# EasyEDA Pro project ProProject_flex_ir_golf_2024-07-23.epro

# Schematic Schematic1
Create Date: 2024-04-06; Page Name: P1; Project Name: flex_ir_golf; Schematic Name: Schematic1; Update Date: 2024-07-07; Company: EasyEDA.com; Drawn: EasyEDA; Page Size: A4; Part Number: JLCPCB-002; Reviewed: EasyEDA; Version: V0.1
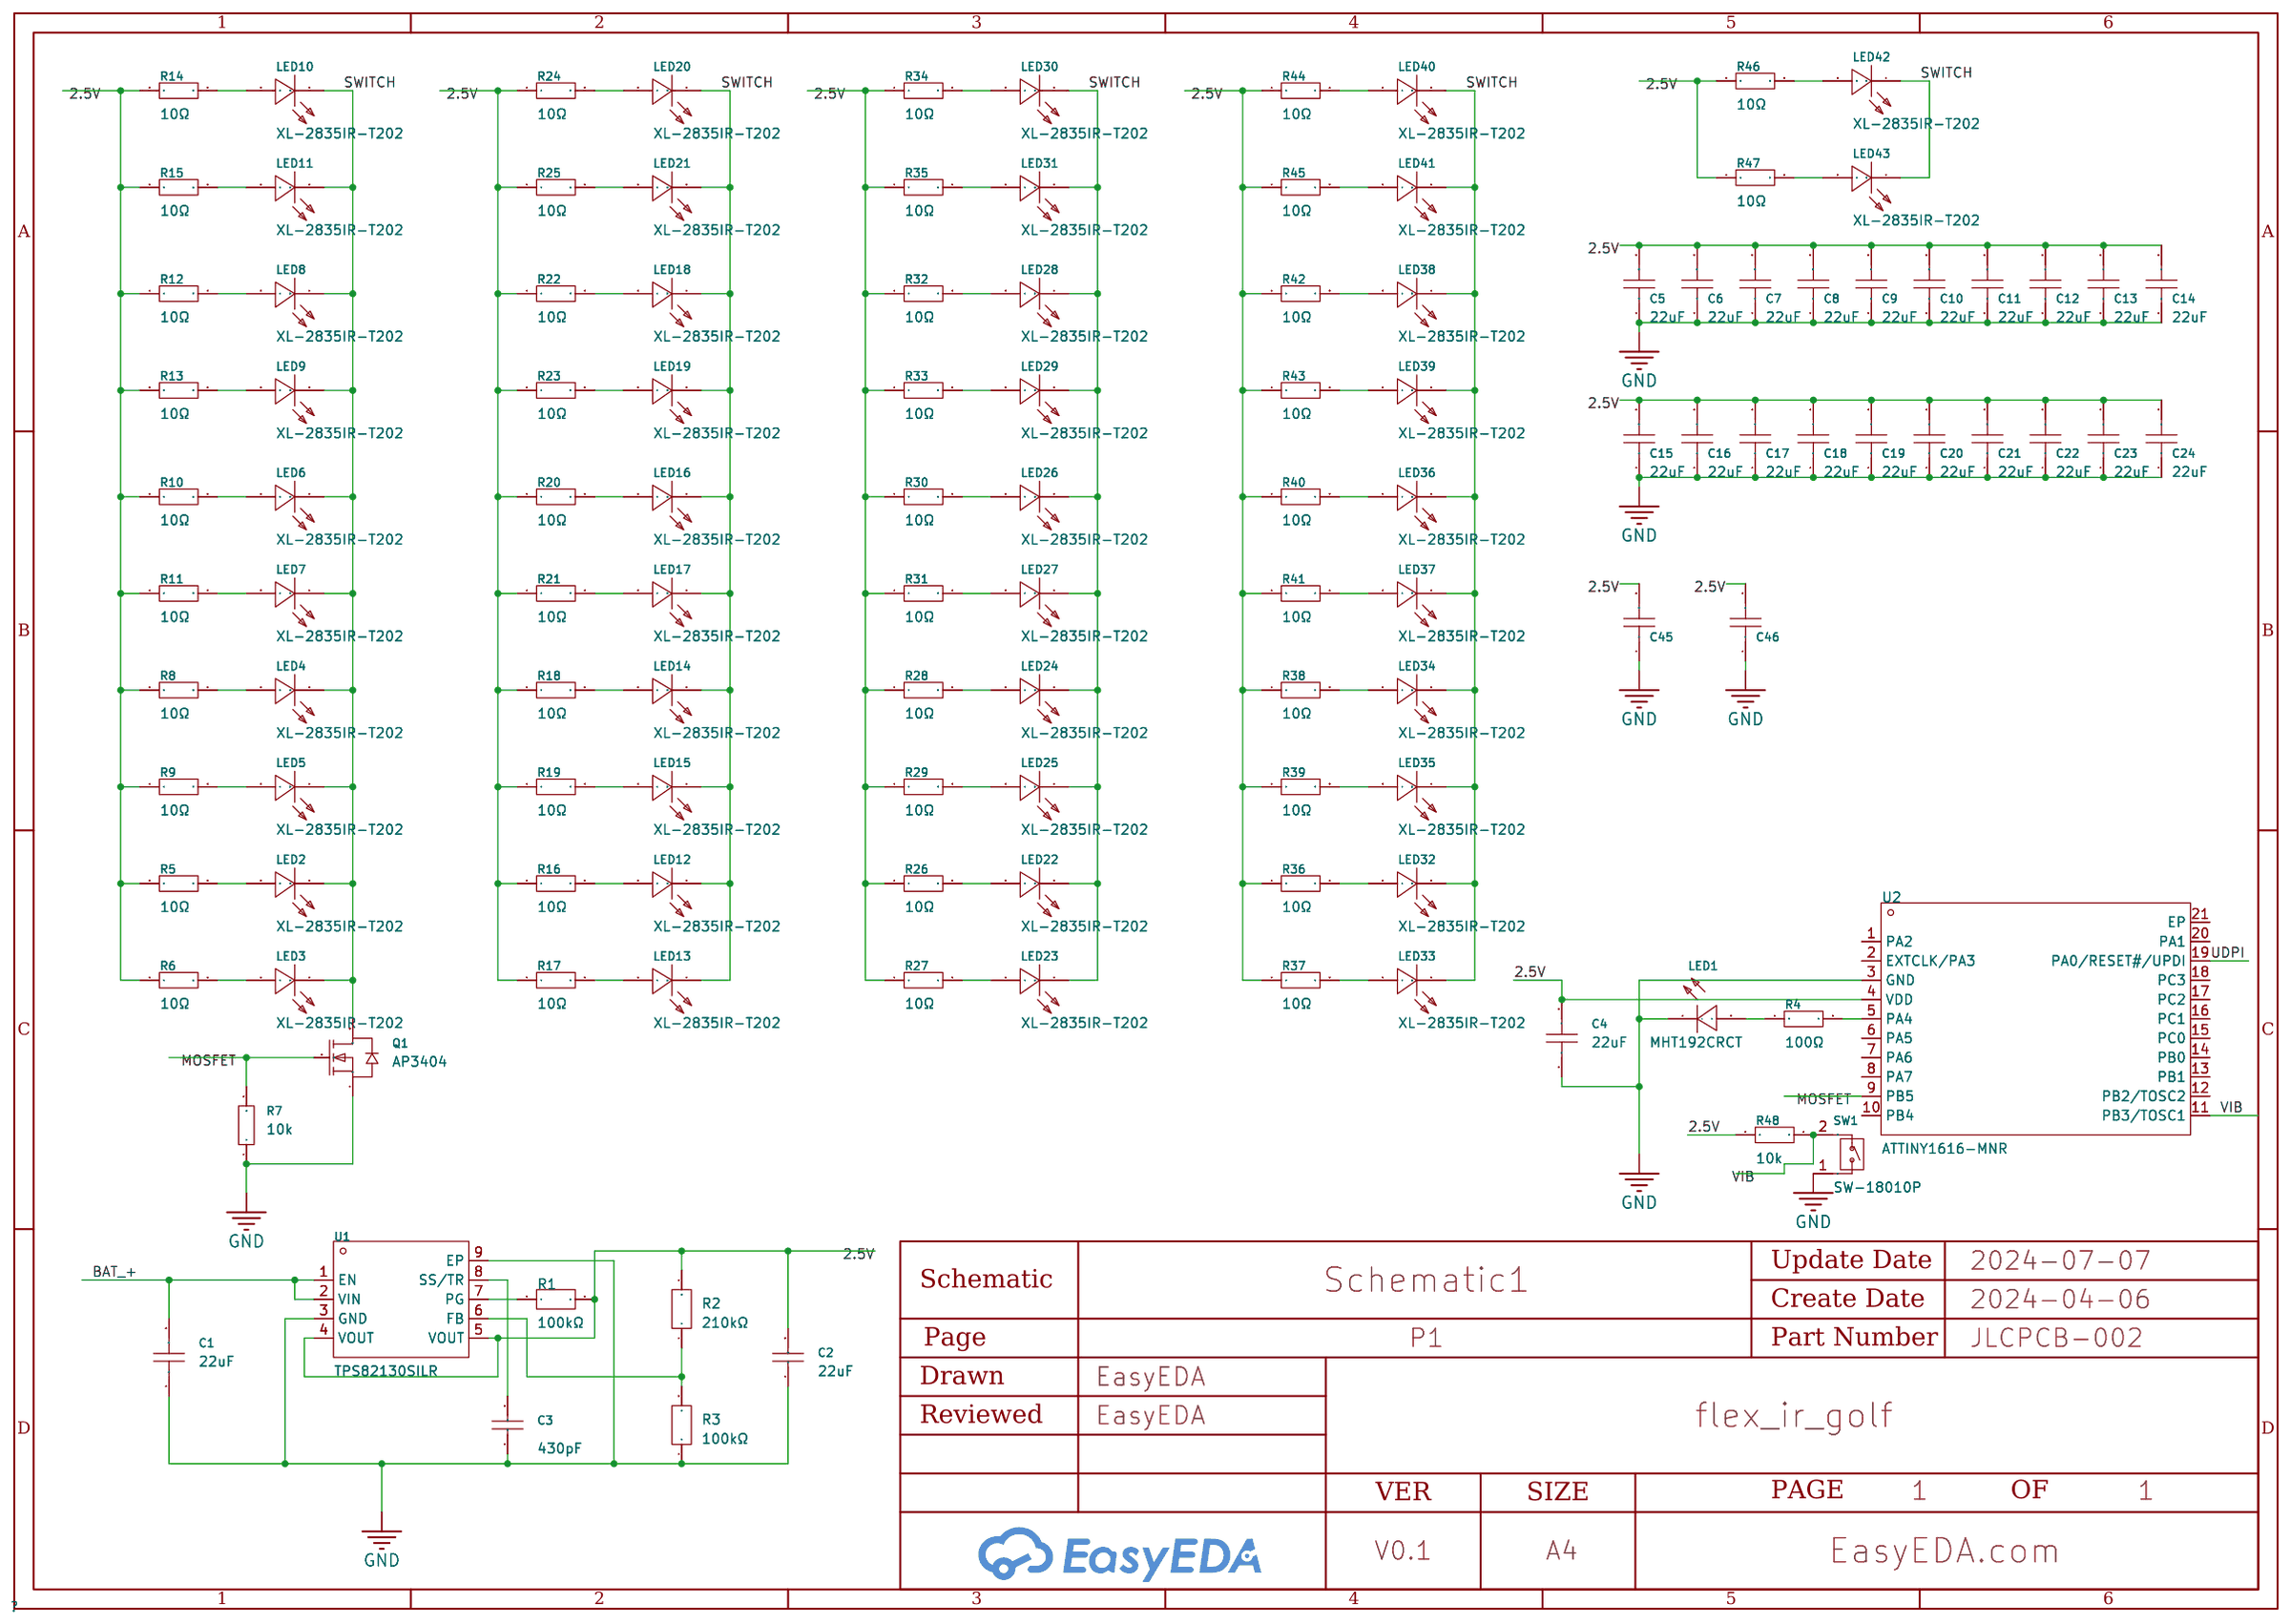
[diagram p0: schematic sheet]

## Parts
C1  22uF  [C0603]
C2  22uF  [C0805]
C3  1uF  [C0402]
C4  22uF  [C0603]
C5  22uF  [C0603]
C6  22uF  [C0603]
C7  22uF  [C0603]
C8  22uF  [C0603]
C9  22uF  [C0603]
C10  22uF  [C0603]
C11  22uF  [C0603]
C12  22uF  [C0603]
C13  22uF  [C0603]
C14  22uF  [C0603]
C15  22uF  [C0603]
C16  22uF  [C0603]
C17  22uF  [C0603]
C18  22uF  [C0603]
C19  22uF  [C0603]
C20  22uF  [C0603]
C21  22uF  [C0603]
C22  22uF  [C0603]
C23  22uF  [C0603]
C24  22uF  [C0603]
C45  22uF  [C0603]
C46  22uF  [C0603]
LED1  MHT192CRCT  [LED0603-RD]
LED2  XL-2835IR-T202  [LED-SMD_L128-XX80CB3500001]
LED3  XL-2835IR-T202  [LED-SMD_L128-XX80CB3500001]
LED4  XL-2835IR-T202  [LED-SMD_L128-XX80CB3500001]
LED5  XL-2835IR-T202  [LED-SMD_L128-XX80CB3500001]
LED6  XL-2835IR-T202  [LED-SMD_L128-XX80CB3500001]
LED7  XL-2835IR-T202  [LED-SMD_L128-XX80CB3500001]
LED8  XL-2835IR-T202  [LED-SMD_L128-XX80CB3500001]
LED9  XL-2835IR-T202  [LED-SMD_L128-XX80CB3500001]
LED10  XL-2835IR-T202  [LED-SMD_L128-XX80CB3500001]
LED11  XL-2835IR-T202  [LED-SMD_L128-XX80CB3500001]
LED12  XL-2835IR-T202  [LED-SMD_L128-XX80CB3500001]
LED13  XL-2835IR-T202  [LED-SMD_L128-XX80CB3500001]
LED14  XL-2835IR-T202  [LED-SMD_L128-XX80CB3500001]
LED15  XL-2835IR-T202  [LED-SMD_L128-XX80CB3500001]
LED16  XL-2835IR-T202  [LED-SMD_L128-XX80CB3500001]
LED17  XL-2835IR-T202  [LED-SMD_L128-XX80CB3500001]
LED18  XL-2835IR-T202  [LED-SMD_L128-XX80CB3500001]
LED19  XL-2835IR-T202  [LED-SMD_L128-XX80CB3500001]
LED20  XL-2835IR-T202  [LED-SMD_L128-XX80CB3500001]
LED21  XL-2835IR-T202  [LED-SMD_L128-XX80CB3500001]
LED22  XL-2835IR-T202  [LED-SMD_L128-XX80CB3500001]
LED23  XL-2835IR-T202  [LED-SMD_L128-XX80CB3500001]
LED24  XL-2835IR-T202  [LED-SMD_L128-XX80CB3500001]
LED25  XL-2835IR-T202  [LED-SMD_L128-XX80CB3500001]
LED26  XL-2835IR-T202  [LED-SMD_L128-XX80CB3500001]
LED27  XL-2835IR-T202  [LED-SMD_L128-XX80CB3500001]
LED28  XL-2835IR-T202  [LED-SMD_L128-XX80CB3500001]
LED29  XL-2835IR-T202  [LED-SMD_L128-XX80CB3500001]
LED30  XL-2835IR-T202  [LED-SMD_L128-XX80CB3500001]
LED31  XL-2835IR-T202  [LED-SMD_L128-XX80CB3500001]
LED32  XL-2835IR-T202  [LED-SMD_L128-XX80CB3500001]
LED33  XL-2835IR-T202  [LED-SMD_L128-XX80CB3500001]
LED34  XL-2835IR-T202  [LED-SMD_L128-XX80CB3500001]
LED35  XL-2835IR-T202  [LED-SMD_L128-XX80CB3500001]
LED36  XL-2835IR-T202  [LED-SMD_L128-XX80CB3500001]
LED37  XL-2835IR-T202  [LED-SMD_L128-XX80CB3500001]
LED38  XL-2835IR-T202  [LED-SMD_L128-XX80CB3500001]
LED39  XL-2835IR-T202  [LED-SMD_L128-XX80CB3500001]
LED40  XL-2835IR-T202  [LED-SMD_L128-XX80CB3500001]
LED41  XL-2835IR-T202  [LED-SMD_L128-XX80CB3500001]
LED42  XL-2835IR-T202  [LED-SMD_L128-XX80CB3500001]
LED43  XL-2835IR-T202  [LED-SMD_L128-XX80CB3500001]
Q1  AP3404  [SOT-23-3_L2.9-W1.3-P1.90-LS2.4-BR-2]
R1  100kΩ  [R0402]
R2  210kΩ  [R0402]
R3  100kΩ  [R0402]
R4  100Ω  [R0402]
R5  10Ω  [R0603]
R6  10Ω  [R0603]
R7  10k  [R0603]
R8  10Ω  [R0603]
R9  10Ω  [R0603]
R10  10Ω  [R0603]
R11  10Ω  [R0603]
R12  10Ω  [R0603]
R13  10Ω  [R0603]
R14  10Ω  [R0603]
R15  10Ω  [R0603]
R16  10Ω  [R0603]
R17  10Ω  [R0603]
R18  10Ω  [R0603]
R19  10Ω  [R0603]
R20  10Ω  [R0603]
R21  10Ω  [R0603]
R22  10Ω  [R0603]
R23  10Ω  [R0603]
R24  10Ω  [R0603]
R25  10Ω  [R0603]
R26  10Ω  [R0603]
R27  10Ω  [R0603]
R28  10Ω  [R0603]
R29  10Ω  [R0603]
R30  10Ω  [R0603]
R31  10Ω  [R0603]
R32  10Ω  [R0603]
R33  10Ω  [R0603]
R34  10Ω  [R0603]
R35  10Ω  [R0603]
R36  10Ω  [R0603]
R37  10Ω  [R0603]
R38  10Ω  [R0603]
R39  10Ω  [R0603]
R40  10Ω  [R0603]
R41  10Ω  [R0603]
R42  10Ω  [R0603]
R43  10Ω  [R0603]
R44  10Ω  [R0603]
R45  10Ω  [R0603]
R46  10Ω  [R0603]
R47  10Ω  [R0603]
R48  10k  [R0603]
SW1  SW-18010P  [SW-TH_SW-18010P]
U1  TPS82130SILR  [USIP-8_L3.0-W2.8-P0.65-TL-EP]
U2  ATTINY1616-MNR  [QFN-20_L3.0-W3.0-P0.40-BL-EP1.7]

## Library data of the parts
C1 C4-C24 C45 C46 = GRM188R60J226MEA0D: Capacitance: Tolerance:±20% Tolerance:±20% Voltage Rated: Temperature Coefficient:; LCSC Part Name: 22uF ±20% 6.3V; Supplier Part: C77042; Manufacturer: muRata(村田); Supplier Footprint: 0603; JLCPCB Part Class: Extended Part; Datasheet: https://atta.szlcsc.com/upload/public/pdf/source/20200305/C490387_23319AE8C154DEB24C505E6C82A8106A.pdf; Supplier: LCSC; Tolerance: ±20%
C2 = GRM21BR60J226ME39L: Capacitance: Tolerance:±20% Tolerance:±20% Voltage Rated: Temperature Coefficient:; LCSC Part Name: 22uF ±20% 6.3V; Supplier Part: C77071; Manufacturer: muRata(村田); Supplier Footprint: 0805; JLCPCB Part Class: Extended Part; Datasheet: https://atta.szlcsc.com/upload/public/pdf/source/20200305/C490387_23319AE8C154DEB24C505E6C82A8106A.pdf; Supplier: LCSC; Tolerance: ±20%
C3 = CL05A105KP5NNNC: Capacitance: Tolerance:±10% Tolerance:±10% Voltage Rated: Temperature Coefficient:; LCSC Part Name: 1uF ±10% 10V; Supplier Part: GRM1555C1H431GA01D; Manufacturer: GRM1555C1H431GA01D; Manufacturer Part: GRM1555C1H431GA01D; Supplier Footprint: 0402; JLCPCB Part Class: Extended Part; Datasheet: https://atta.szlcsc.com/upload/public/pdf/source/20160218/1457707763339.pdf; Supplier: LCSC; Tolerance: ±10%
LED1 = MHT192CRCT: Emitted Color:Red Power Dissipation:60mW Forward Current:5mA Dominant Wavelength:621.5nm~633.5nm Dominant Wavelength:621.5nm~633.5nm Peak Wavelength:639nm Diode Configuration:- Lens Color:无色透明透镜 Color Temperature:- Color Temperature:- Viewing Angle:120° M; LCSC Part Name: 红灯; Supplier Part: C389517; Manufacturer: MEIHUA(美华); Supplier Footprint: 0603; JLCPCB Part Class: Extended Part; Datasheet: https://atta.szlcsc.com/upload/public/pdf/source/20190515/C389517_475281E0F1091F4CD4C8D85EF0064C5B.pdf; Supplier: LCSC; Emitted Color: Red; Power Dissipation: 60mW; Forward Current: 5mA; Dominant Wavelength: 621.5nm~633.5nm; Peak Wavelength: 639nm; Lens Color: 无色透明透镜; Viewing Angle: 120°; Operating Temperature: -40℃~+85℃
LED2-LED43 = L128-4080CB3500001_C358168: Emitted Color:White; LCSC Part Name: 白灯; Supplier Part: C5221243; Manufacturer: Lumileds(亮锐); Supplier Footprint: SMD2835; JLCPCB Part Class: Extended Part; Datasheet: https://atta.szlcsc.com/upload/public/pdf/source/20190124/C358170_8734630ADD1BE4D019D2695C6D605BA1.pdf; Supplier: LCSC; Emitted Color: IR
Q1 = AP3404: Type: Drain Source Voltage (Vdss): Continuous Drain Current (Id): Power Dissipation (Pd): Drain Source On Resistance (RDS(on)@Vgs,Id):18mΩ@10V,5.8A Gate Threshold Voltage (Vgs(th)@Id):1.6V@250uA Total Gate Charge (Qg@Vgs):- Input Capacitance (Ciss@Vds):34; LCSC Part Name: N沟道 耐压:30V 电流:5.8A; Supplier Part: C2842665; Manufacturer: ALLPOWER(铨力); Supplier Footprint: SOT-23; JLCPCB Part Class: Extended Part; Datasheet: https://atta.szlcsc.com/upload/public/pdf/source/20210629/C2842665_6746D340194B1D8C1AEB6994A54BD307.pdf; Supplier: LCSC; Drain Source On Resistance (RDS(on)@Vgs,Id): 18mΩ@10V,5.8A; Gate Threshold Voltage (Vgs(th)@Id): 1.6V@250uA; Input Capacitance (Ciss@Vds): 345pF@15V; Reverse Transfer Capacitance (Crss@Vds): 32pF@15V; Operating Temperature: -55℃~+150℃@(Tj)
R1 R3 = CRCW0402100KFKED: Type:Thick Film Resistors Resistance: Tolerance:±1% Tolerance:±1% Power(Watts): Overload Voltage (Max): Temperature Coefficient:±100ppm/℃ Temperature Coefficient:±100ppm/℃ Operating Temperature Range:-55℃~+155℃ Operating Temperature Range:-55℃~+155℃; LCSC Part Name: 厚膜电阻 100kΩ ±1% 63mW; Supplier Part: C481918; Manufacturer: VISHAY(威世); Supplier Footprint: 0402; JLCPCB Part Class: Extended Part; Datasheet: https://atta.szlcsc.com/upload/public/pdf/source/20200618/C481956_E25174B008CE8C884BEDD7D4D15E674F.pdf; Supplier: LCSC; Type: Thick Film Resistors; Tolerance: ±1%; Temperature Coefficient: ±100ppm/℃; Operating Temperature Range: -55℃~+155℃
R2 = CRCW0402210KFKED: Type:Thick Film Resistors Resistance: Tolerance:±1% Tolerance:±1% Power(Watts): Overload Voltage (Max): Temperature Coefficient:±100ppm/℃ Temperature Coefficient:±100ppm/℃ Operating Temperature Range:-55℃~+155℃ Operating Temperature Range:-55℃~+155℃; LCSC Part Name: 厚膜电阻 210kΩ ±1% 62.5mW; Supplier Part: C482099; Manufacturer: VISHAY(威世); Supplier Footprint: 0402; JLCPCB Part Class: Extended Part; Datasheet: https://atta.szlcsc.com/upload/public/pdf/source/20200618/C481956_E25174B008CE8C884BEDD7D4D15E674F.pdf; Supplier: LCSC; Type: Thick Film Resistors; Tolerance: ±1%; Temperature Coefficient: ±100ppm/℃; Operating Temperature Range: -55℃~+155℃
R4 = 0402WGF1000TCE: Type:Thick Film Resistors Resistance: Tolerance:±1% Tolerance:±1% Power(Watts): Overload Voltage (Max): Temperature Coefficient:±200ppm/℃ Temperature Coefficient:±200ppm/℃ Operating Temperature Range:-55℃~+155℃ Operating Temperature Range:-55℃~+155℃; LCSC Part Name: 100Ω ±1% 62.5mW 厚膜电阻; Supplier Part: C25076; Manufacturer: UNI-ROYAL(厚声); Supplier Footprint: 0402; JLCPCB Part Class: Basic Part; Datasheet: https://atta.szlcsc.com/upload/public/pdf/source/20200306/C422600_1E6D84923E4A46A82E41ADD87F860B5C.pdf; Supplier: LCSC; Type: Thick Film Resistors; Tolerance: ±1%; Temperature Coefficient: ±200ppm/℃; Operating Temperature Range: -55℃~+155℃
R5-R48 = 0603WAF100JT5E: Type:Thick Film Resistors Resistance:10Ω Tolerance:±1% Tolerance:±1% Power(Watts): Overload Voltage (Max): Temperature Coefficient:±400ppm/℃ Temperature Coefficient:±400ppm/℃ Operating Temperature Range:-55℃~+155℃ Operating Temperature Range:-55℃~+155℃; LCSC Part Name: 10Ω ±1% 100mW 厚膜电阻; Supplier Part: C22859; Manufacturer: UNI-ROYAL(厚声); Supplier Footprint: 0603; JLCPCB Part Class: Basic Part; Datasheet: https://atta.szlcsc.com/upload/public/pdf/source/20200306/C422600_1E6D84923E4A46A82E41ADD87F860B5C.pdf; Supplier: LCSC; Type: Thick Film Resistors; Tolerance: ±1%; Temperature Coefficient: ±400ppm/℃; Operating Temperature Range: -55℃~+155℃
SW1 = SW-18010P: Sensor Type:- Rated Voltage:12V Rated Current:20mA Operating Life:100万次 Temperature Resistance:- Temperature Resistance:-; LCSC Part Name: 高灵敏震动开关SW-18010P 玩具限位弹簧开关抖动振动开关 黑色直脚; Supplier Part: C2681585; Manufacturer: SHOU HAN(首韩); Supplier Footprint: 插件; JLCPCB Part Class: Extended Part; Datasheet: https://atta.szlcsc.com/upload/public/pdf/source/20210122/C2681585_58E357A0608CE0F21BF5D2CFA19487E4.pdf; Supplier: LCSC; Rated Voltage: 12V; Rated Current: 20mA; Operating Life: 100万次
U1 = TPS82130SILR: Input Voltage(DC):3V~17V Input Voltage(DC):3V~17V Output Voltage:900mV~6V Output Voltage:900mV~6V Output Current (Max):3A Output Current (Max):3A Function:- Output Channel:1; Supplier Part: C473914; Manufacturer: TI(德州仪器); Supplier Footprint: USIP-8; JLCPCB Part Class: Extended Part; Datasheet: https://www.ti.com/cn/lit/gpn/tps82130; Supplier: LCSC; Input Voltage(DC): 3V~17V; Output Voltage: 900mV~6V; Output Current (Max): 3A; Output Channel: 1
U2 = ATTINY1616-MNR: CPU Core:AVR Program Storage Size:16KB RAM Size:2KB GPIO Ports Number:18 Operating Voltage Range:1.8V~5.5V Operating Voltage Range:1.8V~5.5V CPU Maximum Speed:20MHz Program Memory Type:FLASH Operating Temperature Range:-40℃~+105℃ Operating Temperature Ran; Supplier Part: C507118; Manufacturer: MICROCHIP(美国微芯); Supplier Footprint: QFN-20-EP(3x3); JLCPCB Part Class: Extended Part; Datasheet: https://atta.szlcsc.com/upload/public/pdf/source/20200402/C507118_C9B3D13493A25E1DA778A35EE1D23665.pdf; Supplier: LCSC; CPU Core: AVR; Program Storage Size: 16KB; RAM Size: 2KB; GPIO Ports Number: 18; Operating Voltage Range: 1.8V~5.5V; CPU Maximum Speed: 20MHz; Program Memory Type: FLASH; Operating Temperature Range: -40℃~+105℃; ADC (Bit): 10bit; DAC (Bit): 8bit; Peripheral/Function: WDT；PWM; Watchdog: 有; Infrared Data Association: 有; Low-Voltage Detect: 有; Internal Oscillator: 有

## Nets
2.5V: C2.2 C4.2 C5.2 C6.2 C7.2 C8.2 C9.2 C10.2 C11.2 C12.2 C13.2 C14.2 C15.2 C16.2 C17.2 C18.2 C19.2 C20.2 C21.2 C22.2 C23.2 C24.2 C45.2 C46.2 R1.2 R2.2 R5.1 R6.1 R8.1 R9.1 R10.1 R11.1 R12.1 R13.1 R14.1 R15.1 R16.1 R17.1 R18.1 R19.1 R20.1 R21.1 R22.1 R23.1 R24.1 R25.1 R26.1 R27.1 R28.1 R29.1 R30.1 R31.1 R32.1 R33.1 R34.1 R35.1 R36.1 R37.1 R38.1 R39.1 R40.1 R41.1 R42.1 R43.1 R44.1 R45.1 R46.1 R47.1 R48.2 U1.4(VOUT) U1.5(VOUT) U2.4(VDD)
GND: C1.1 C2.1 C3.1 C4.1 C5.1 C6.1 C7.1 C8.1 C9.1 C10.1 C11.1 C12.1 C13.1 C14.1 C15.1 C16.1 C17.1 C18.1 C19.1 C20.1 C21.1 C22.1 C23.1 C24.1 C45.1 C46.1 LED1.1(-) Q1.1(S) R3.1 R7.1 SW1.1 U1.3(GND) U1.9(EP) U2.3(GND)
BAT_+: C1.2 U1.1(EN) U1.2(VIN)
MOSFET: Q1.2(G) R7.2 U2.9(PB5)
SWITCH: LED2.1(C) LED3.1(C) LED4.1(C) LED5.1(C) LED6.1(C) LED7.1(C) LED8.1(C) LED9.1(C) LED10.1(C) LED11.1(C) LED12.1(C) LED13.1(C) LED14.1(C) LED15.1(C) LED16.1(C) LED17.1(C) LED18.1(C) LED19.1(C) LED20.1(C) LED21.1(C) LED22.1(C) LED23.1(C) LED24.1(C) LED25.1(C) LED26.1(C) LED27.1(C) LED28.1(C) LED29.1(C) LED30.1(C) LED31.1(C) LED32.1(C) LED33.1(C) LED34.1(C) LED35.1(C) LED36.1(C) LED37.1(C) LED38.1(C) LED39.1(C) LED40.1(C) LED41.1(C) LED42.1(C) LED43.1(C) Q1.3(D)
UDPI: U2.19(PA0/RESET#/UPDI)
VIB: R48.1 SW1.2 U2.11(PB3/TOSC1)
$1N1273: R1.1 U1.7(PG)
$1N1291: C3.2 U1.8(SS/TR)
$1N1523: R2.1 R3.2 U1.6(FB)
$1N2150: R4.2 U2.5(PA4)
$1N2153: LED1.2(+) R4.1
$1N2397: LED2.2(A) R5.2
$1N2467: LED3.2(A) R6.2
$1N2959: LED4.2(A) R8.2
$1N2961: LED5.2(A) R9.2
$1N3108: LED6.2(A) R10.2
$1N3110: LED7.2(A) R11.2
$1N3257: LED8.2(A) R12.2
$1N3259: LED9.2(A) R13.2
$1N3406: LED10.2(A) R14.2
$1N3408: LED11.2(A) R15.2
$1N4472: LED12.2(A) R16.2
$1N4474: LED13.2(A) R17.2
$1N4476: LED14.2(A) R18.2
$1N4478: LED15.2(A) R19.2
$1N4480: LED16.2(A) R20.2
$1N4482: LED17.2(A) R21.2
$1N4484: LED18.2(A) R22.2
$1N4486: LED19.2(A) R23.2
$1N4488: LED20.2(A) R24.2
$1N4490: LED21.2(A) R25.2
$1N5215: LED22.2(A) R26.2
$1N5217: LED23.2(A) R27.2
$1N5219: LED24.2(A) R28.2
$1N5221: LED25.2(A) R29.2
$1N5223: LED26.2(A) R30.2
$1N5225: LED27.2(A) R31.2
$1N5227: LED28.2(A) R32.2
$1N5229: LED29.2(A) R33.2
$1N5231: LED30.2(A) R34.2
$1N5233: LED31.2(A) R35.2
$1N5958: LED32.2(A) R36.2
$1N5960: LED33.2(A) R37.2
$1N5962: LED34.2(A) R38.2
$1N5964: LED35.2(A) R39.2
$1N5966: LED36.2(A) R40.2
$1N5968: LED37.2(A) R41.2
$1N5970: LED38.2(A) R42.2
$1N5972: LED39.2(A) R43.2
$1N5974: LED40.2(A) R44.2
$1N5976: LED41.2(A) R45.2
$1N6160: LED42.2(A) R46.2
$1N6162: LED43.2(A) R47.2

Not connected (* = marked no-connect by the designer): U2 1(PA2) 2(EXTCLK/PA3) 6(PA5) 7(PA6) 8(PA7) 10(PB4) 12(PB2/TOSC2) 13(PB1) 14(PB0) 15(PC0) 16(PC1) 17(PC2) 18(PC3) 20(PA1) 21(EP)

# Board PCB1
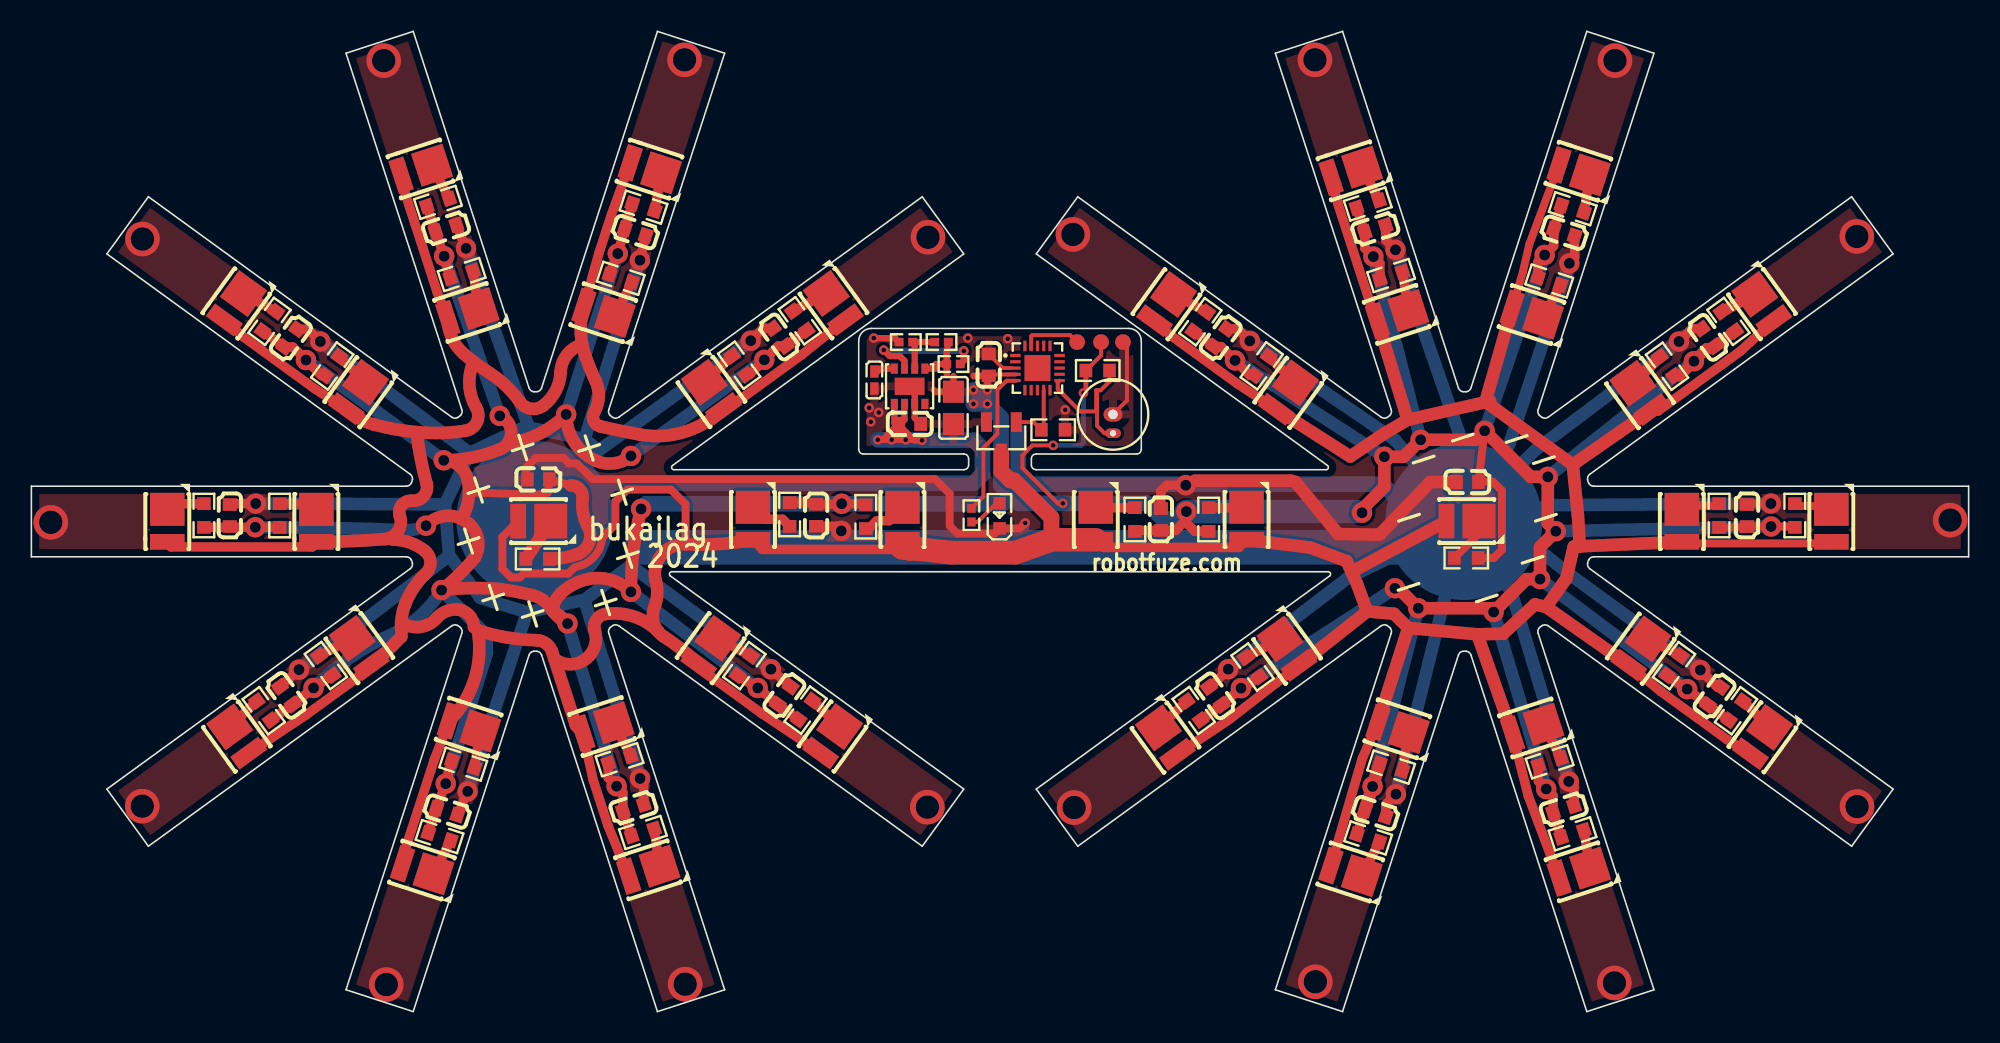
[diagram p1: board, top side]
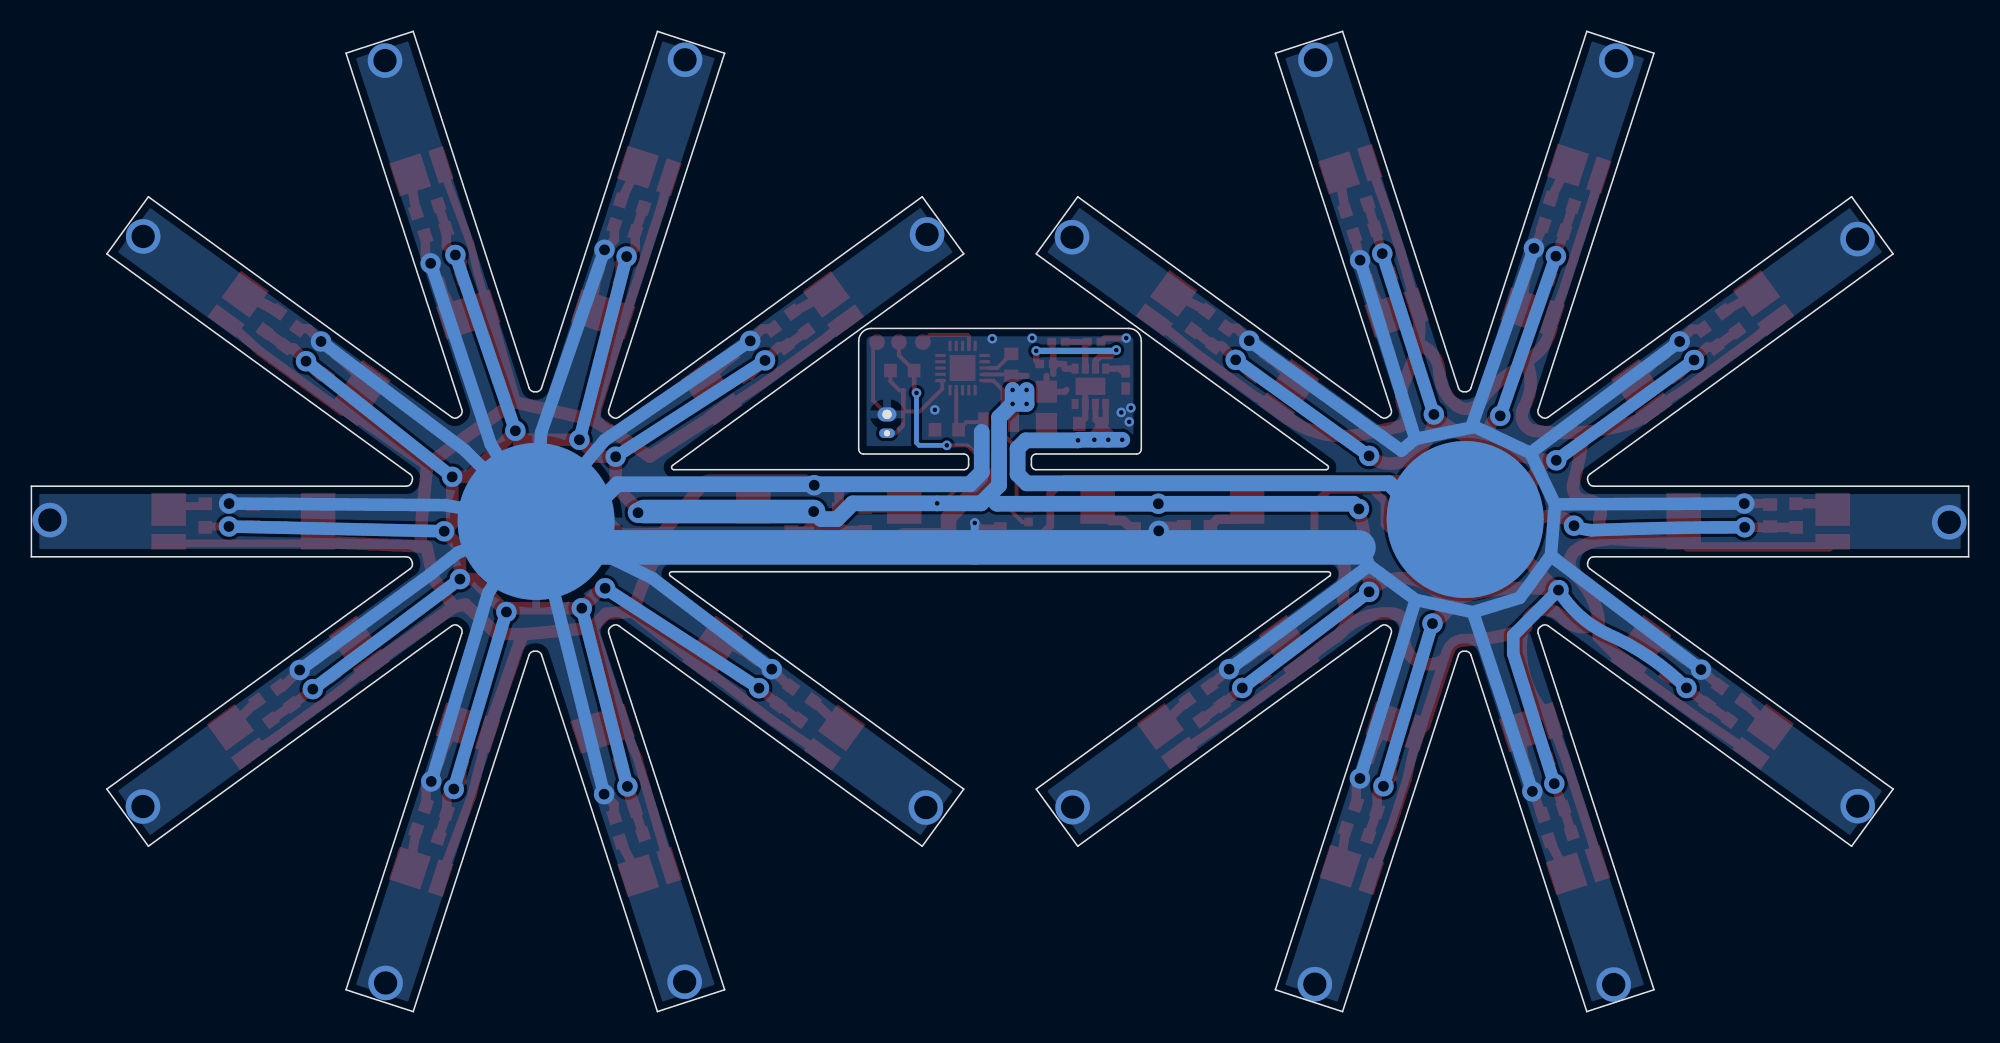
[diagram p2: board, bottom side, seen from below]

Outline 123.4 x 62.45 mm; copper layers: Top Layer, Bottom Layer. Coordinates in mm from the lower left corner of the outline.
Outline path: 0,33.47 0,28.97 23.89,28.97 arc(24.07,28.92) 24.2,28.78 arc(24.24,28.67) 24.27,28.56 arc(24.25,28.37) 24.13,28.22 4.81,14.18 7.45,10.54 26.78,24.58 arc(26.96,24.64) 27.15,24.6 arc(27.25,24.54) 27.33,24.47 arc(27.43,24.3) 27.42,24.11 20.04,1.39 24.32,0 31.7,22.72 arc(31.81,22.88) 31.98,22.96 arc(32.1,22.96) 32.22,22.96 arc(32.39,22.88) 32.5,22.72 39.88,0 44.16,1.39 36.78,24.11 arc(36.77,24.3) 36.87,24.47 arc(36.96,24.54) 37.06,24.6 arc(37.24,24.64) 37.42,24.58 56.75,10.54 59.39,14.18 40.71,27.75 arc(40.65,27.92) 40.8,28.02 82.61,28.02 arc(82.75,27.92) 82.7,27.75 64.01,14.18 66.66,10.54 85.98,24.58 arc(86.16,24.64) 86.35,24.6 arc(86.45,24.54) 86.54,24.47 arc(86.63,24.3) 86.62,24.11 79.24,1.39 83.52,0 90.9,22.72 arc(91.01,22.88) 91.19,22.96 arc(91.3,22.96) 91.42,22.96 arc(91.59,22.88) 91.7,22.72 99.08,0 103.36,1.39 95.98,24.11 arc(95.97,24.3) 96.07,24.47 arc(96.16,24.54) 96.26,24.6 arc(96.45,24.64) 96.63,24.58 115.95,10.54 118.6,14.18 99.27,28.22 arc(99.15,28.37) 99.13,28.56 arc(99.16,28.67) 99.2,28.78 arc(99.33,28.92) 99.52,28.97 123.4,28.97 123.4,33.47 99.52,33.47 arc(99.33,33.53) 99.2,33.67 arc(99.16,33.78) 99.13,33.89 arc(99.15,34.08) 99.27,34.23 118.6,48.27 115.95,51.91 96.63,37.87 arc(96.45,37.81) 96.26,37.85 arc(96.16,37.91) 96.07,37.98 arc(95.97,38.15) 95.98,38.34 103.36,61.06 99.08,62.45 91.7,39.73 arc(91.59,39.57) 91.42,39.49 arc(91.3,39.49) 91.19,39.49 arc(91.01,39.57) 90.9,39.73 83.52,62.45 79.24,61.06 86.62,38.34 arc(86.63,38.15) 86.54,37.98 arc(86.45,37.91) 86.35,37.85 arc(86.16,37.81) 85.98,37.87 66.66,51.91 64.01,48.27 82.56,34.8 arc(82.61,34.63) 82.47,34.52 64,34.52 arc(63.79,34.61) 63.7,34.82 63.7,35.22 arc(63.79,35.44) 64,35.52 70.4,35.52 arc(70.61,35.61) 70.7,35.82 70.7,42.73 arc(70.47,43.29) 69.9,43.52 53.5,43.52 arc(52.94,43.29) 52.7,42.73 52.7,35.82 arc(52.79,35.61) 53,35.52 59.4,35.52 arc(59.61,35.44) 59.7,35.22 59.7,34.82 arc(59.61,34.61) 59.4,34.52 40.93,34.52 arc(40.79,34.63) 40.84,34.8 59.39,48.27 56.75,51.91 37.42,37.87 arc(37.24,37.81) 37.06,37.85 arc(36.96,37.91) 36.87,37.98 arc(36.77,38.15) 36.78,38.34 44.16,61.06 39.88,62.45 32.5,39.73 arc(32.39,39.57) 32.22,39.49 arc(32.1,39.49) 31.98,39.49 arc(31.81,39.57) 31.7,39.73 24.32,62.45 20.04,61.06 27.42,38.34 arc(27.43,38.15) 27.33,37.98 arc(27.25,37.91) 27.15,37.85 arc(26.96,37.81) 26.78,37.87 7.45,51.91 4.81,48.27 24.13,34.23 arc(24.25,34.08) 24.27,33.89 arc(24.24,33.78) 24.2,33.67 arc(24.07,33.53) 23.89,33.47 0,33.47
Stack: Top Layer 0.012mm / Dielectric1 0.025mm FR4 er 4.5 / Bottom Layer 0.012mm

## Design rules (mm)
template: Custom Config
spacing copperThickness1oz (default): track to track 0.102, other pairs 0.152 to 0.3
spacing copperThickness2oz: track to track 0.203, other pairs 0.152 to 0.3
track width copperThickness1oz (default): min 0.127, default 0.254, max 2.54
track width copperThickness2oz: min 0.203, default 0.254, max 2.54
differential pair differentialPair (default): width min 0.127, default 0.254, max 2.54; gap min 0.152, default 0.152
via viaSize (default): diameter min 0.5, default 0.61, max 10; hole min 0.3, default 0.305, max 6.3
pour e281 uses copperRegion

## Placement (name value [footprint] x y rotation side)
C1  22uF  [C0603]  55.95 37.45 180 top
C2  22uF  [C0805]  58.74 38.46 90 top
C3  1uF  [C0402]  53.7 40.24 90 top
C4  22uF  [C0603]  60.98 41.2 270 top
C5  22uF  [C0603]  71.95 31.35 270 top
C6  22uF  [C0603]  109.29 31.61 270 top
C7  22uF  [C0603]  26.47 12.75 162 top
C8  22uF  [C0603]  26.41 49.91 198 top
C9  22uF  [C0603]  38.34 12.99 198 top
C10  22uF  [C0603]  85.6 49.87 198 top
C11  22uF  [C0603]  97.6 12.9 198 top
C12  22uF  [C0603]  12.64 31.61 270 top
C13  22uF  [C0603]  49.99 31.62 90 top
C14  22uF  [C0603]  16.53 42.91 234 top
C15  22uF  [C0603]  97.64 49.63 162 top
C16  22uF  [C0603]  85.61 12.64 162 top
C17  22uF  [C0603]  38.47 49.66 162 top
C18  22uF  [C0603]  106.81 42.95 306 top
C19  22uF  [C0603]  75.42 20.11 306 top
C20  22uF  [C0603]  47.64 42.97 306 top
C21  22uF  [C0603]  16.25 20.14 306 top
C22  22uF  [C0603]  75.76 42.93 234 top
C23  22uF  [C0603]  47.96 20.14 234 top
C24  22uF  [C0603]  91.48 33.74 0 top
C45  22uF  [C0603]  107.22 20.1 234 top
C46  22uF  [C0603]  32.3 33.9 0 top
LED1  MHT192CRCT  [LED0603-RD]  61.67 31.58 90 top
LED2  XL-2835IR-T202  [LED-SMD_L128-XX80CB3500001]  110.11 17.27 54 top
LED3  XL-2835IR-T202  [LED-SMD_L128-XX80CB3500001]  102.37 22.91 54 top
LED4  XL-2835IR-T202  [LED-SMD_L128-XX80CB3500001]  105.14 30.96 90 top
LED5  XL-2835IR-T202  [LED-SMD_L128-XX80CB3500001]  114.66 30.96 90 top
LED6  XL-2835IR-T202  [LED-SMD_L128-XX80CB3500001]  67.8 31.09 90 top
LED7  XL-2835IR-T202  [LED-SMD_L128-XX80CB3500001]  77.41 31.1 90 top
LED8  XL-2835IR-T202  [LED-SMD_L128-XX80CB3500001]  45.96 31.09 90 top
LED9  XL-2835IR-T202  [LED-SMD_L128-XX80CB3500001]  55.49 31.09 90 top
LED10  XL-2835IR-T202  [LED-SMD_L128-XX80CB3500001]  8.66 30.96 90 top
LED11  XL-2835IR-T202  [LED-SMD_L128-XX80CB3500001]  18.15 30.96 90 top
LED12  XL-2835IR-T202  [LED-SMD_L128-XX80CB3500001]  79.91 39.21 54 top
LED13  XL-2835IR-T202  [LED-SMD_L128-XX80CB3500001]  72.15 44.85 54 top
LED14  XL-2835IR-T202  [LED-SMD_L128-XX80CB3500001]  36.11 18.08 18 top
LED15  XL-2835IR-T202  [LED-SMD_L128-XX80CB3500001]  39.03 8.95 18 top
LED16  XL-2835IR-T202  [LED-SMD_L128-XX80CB3500001]  24.54 53.61 18 top
LED17  XL-2835IR-T202  [LED-SMD_L128-XX80CB3500001]  27.51 44.47 18 top
LED18  XL-2835IR-T202  [LED-SMD_L128-XX80CB3500001]  95.34 17.99 18 top
LED19  XL-2835IR-T202  [LED-SMD_L128-XX80CB3500001]  98.31 8.82 18 top
LED20  XL-2835IR-T202  [LED-SMD_L128-XX80CB3500001]  83.78 53.48 18 top
LED21  XL-2835IR-T202  [LED-SMD_L128-XX80CB3500001]  86.73 44.34 18 top
LED22  XL-2835IR-T202  [LED-SMD_L128-XX80CB3500001]  43.11 22.94 54 top
LED23  XL-2835IR-T202  [LED-SMD_L128-XX80CB3500001]  50.88 17.32 54 top
LED24  XL-2835IR-T202  [LED-SMD_L128-XX80CB3500001]  95.31 44.49 342 top
LED25  XL-2835IR-T202  [LED-SMD_L128-XX80CB3500001]  98.3 53.63 342 top
LED26  XL-2835IR-T202  [LED-SMD_L128-XX80CB3500001]  83.77 8.98 342 top
LED27  XL-2835IR-T202  [LED-SMD_L128-XX80CB3500001]  86.76 18.1 342 top
LED28  XL-2835IR-T202  [LED-SMD_L128-XX80CB3500001]  36.18 44.61 342 top
LED29  XL-2835IR-T202  [LED-SMD_L128-XX80CB3500001]  39.13 53.76 342 top
LED30  XL-2835IR-T202  [LED-SMD_L128-XX80CB3500001]  24.63 9.1 342 top
LED31  XL-2835IR-T202  [LED-SMD_L128-XX80CB3500001]  27.61 18.21 342 top
LED32  XL-2835IR-T202  [LED-SMD_L128-XX80CB3500001]  20.67 39.25 54 top
LED33  XL-2835IR-T202  [LED-SMD_L128-XX80CB3500001]  12.9 44.91 54 top
LED34  XL-2835IR-T202  [LED-SMD_L128-XX80CB3500001]  80.14 22.9 126 top
LED35  XL-2835IR-T202  [LED-SMD_L128-XX80CB3500001]  72.4 17.24 126 top
LED36  XL-2835IR-T202  [LED-SMD_L128-XX80CB3500001]  110.39 44.86 126 top
LED37  XL-2835IR-T202  [LED-SMD_L128-XX80CB3500001]  102.62 39.19 126 top
LED38  XL-2835IR-T202  [LED-SMD_L128-XX80CB3500001]  43.47 39.26 126 top
LED39  XL-2835IR-T202  [LED-SMD_L128-XX80CB3500001]  51.25 44.92 126 top
LED40  XL-2835IR-T202  [LED-SMD_L128-XX80CB3500001]  21.05 22.94 126 top
LED41  XL-2835IR-T202  [LED-SMD_L128-XX80CB3500001]  13.24 17.3 126 top
LED42  XL-2835IR-T202  [LED-SMD_L128-XX80CB3500001]  91.18 31.25 0 top
LED43  XL-2835IR-T202  [LED-SMD_L128-XX80CB3500001]  32.05 31.25 0 top
NOREF  -  [Pad_e599]  91.25 31.22 0 top
NOREF#2  -  [Pad_e747]  66.61 42.66 0 top
NOREF#3  -  [Pad_e597]  32.07 31.35 0 top
NOREF#4  -  [Pad_e759]  68.14 42.66 0 top
NOREF#5  -  [Pad_e760]  69.54 42.66 0 top
Q1  AP3404  [SOT-23-3_L2.9-W1.3-P1.90-LS2.4-BR-2]  61.79 36.56 180 top
R1  100kΩ  [R0402]  58.74 41.26 180 top
R2  210kΩ  [R0402]  57.98 42.66 0 top
R3  100kΩ  [R0402]  55.7 42.66 0 top
R4  100Ω  [R0402]  59.88 31.63 90 top
R5  10Ω  [R0603]  108.59 19.17 54 top
R6  10Ω  [R0603]  104.64 22.04 54 top
R7  10k  [R0603]  65.09 37.07 180 top
R8  10Ω  [R0603]  107.51 31.61 90 top
R9  10Ω  [R0603]  112.33 31.61 90 top
R10  10Ω  [R0603]  70.3 31.35 90 top
R11  10Ω  [R0603]  75 31.35 90 top
R12  10Ω  [R0603]  48.3 31.67 270 top
R13  10Ω  [R0603]  53.15 31.53 270 top
R14  10Ω  [R0603]  10.99 31.61 90 top
R15  10Ω  [R0603]  15.81 31.61 90 top
R16  10Ω  [R0603]  78.37 41.14 54 top
R17  10Ω  [R0603]  74.46 43.95 54 top
R18  10Ω  [R0603]  37.47 16.05 18 top
R19  10Ω  [R0603]  38.95 11.41 18 top
R20  10Ω  [R0603]  25.9 51.56 18 top
R21  10Ω  [R0603]  27.41 46.96 18 top
R22  10Ω  [R0603]  96.71 15.91 18 top
R23  10Ω  [R0603]  98.17 11.32 18 top
R24  10Ω  [R0603]  85.13 51.45 18 top
R25  10Ω  [R0603]  86.62 46.9 18 top
R26  10Ω  [R0603]  45.42 22.04 54 top
R27  10Ω  [R0603]  49.32 19.21 54 top
R28  10Ω  [R0603]  96.69 46.54 342 top
R29  10Ω  [R0603]  98.19 51.15 342 top
R30  10Ω  [R0603]  85.15 11.06 342 top
R31  10Ω  [R0603]  86.62 15.58 342 top
R32  10Ω  [R0603]  37.54 46.72 342 top
R33  10Ω  [R0603]  38.99 51.25 342 top
R34  10Ω  [R0603]  26 11.15 342 top
R35  10Ω  [R0603]  27.51 15.77 342 top
R36  10Ω  [R0603]  19.17 41.13 54 top
R37  10Ω  [R0603]  15.17 43.98 54 top
R38  10Ω  [R0603]  77.79 21.95 126 top
R39  10Ω  [R0603]  74.04 19.18 126 top
R40  10Ω  [R0603]  108.11 43.98 126 top
R41  10Ω  [R0603]  104.19 41.12 126 top
R42  10Ω  [R0603]  45.09 41.18 126 top
R43  10Ω  [R0603]  48.95 44.01 126 top
R44  10Ω  [R0603]  18.76 22.05 126 top
R45  10Ω  [R0603]  14.8 19.17 126 top
R46  10Ω  [R0603]  91.4 28.9 180 top
R47  10Ω  [R0603]  32.25 28.84 180 top
R48  10k  [R0603]  67.93 40.84 180 top
SW1  SW-18010P  [SW-TH_SW-18010P]  68.9 37.45 90 top
U1  TPS82130SILR  [USIP-8_L3.0-W2.8-P0.65-TL-EP]  55.94 39.84 90 top
U2  ATTINY1616-MNR  [QFN-20_L3.0-W3.0-P0.40-BL-EP1.7]  64.09 41 270 top

## Footprints (pads in the part's own frame, mm; a bottom-side part is the same pattern mirrored in y, then rotated)
C0402
  rect 0.79x0.54 smd: 1(-0.545,0) 2(0.545,0)
C0603
  rect 0.8x0.9 smd: 1(-0.7,0) 2(0.7,0)
C0805
  rect 1.41x1.35 smd: 1(-1.03,0) 2(1.03,0)
LED0603-RD
  rect 0.8x0.8 smd: 1(-0.799,-0.004) 2(0.799,0.004)
LED-SMD_L128-XX80CB3500001
  rect 1x2.2 smd: 1(-1.035,0)
  rect 2.1x2.2 smd: 2(1.035,0)
Pad_e597
  round 10 smd far side: 5(0,0)
Pad_e599
  round 10 smd far side: 5(0,0)
Pad_e747
  round 1 smd: 4(0,0)
Pad_e759
  round 1 smd: 6(0,0)
Pad_e760
  round 1 smd: 7(0,0)
QFN-20_L3.0-W3.0-P0.40-BL-EP1.7
  rect 0.2x0.665 smd: 1(-0.8,-1.407) 2(-0.4,-1.407) 3(0,-1.407) 4(0.4,-1.407) 5(0.8,-1.407) 11(0.8,1.407) 12(0.4,1.407) 13(0,1.407) 14(-0.4,1.407) 15(-0.8,1.407)
  rect 0.665x0.2 smd: 6(1.407,-0.8) 7(1.407,-0.4) 8(1.407,0) 9(1.407,0.4) 10(1.407,0.8) 16(-1.407,0.8) 17(-1.407,0.4) 18(-1.407,0) 19(-1.407,-0.4) 20(-1.407,-0.8)
  rect 1.65x1.65 smd: 21(0,0)
R0402
  rect 0.566x0.54 smd: 1(-0.433,0) 2(0.433,0)
R0603
  rect 0.806x0.864 smd: 1(-0.753,0) 2(0.753,0)
SOT-23-3_L2.9-W1.3-P1.90-LS2.4-BR-2
  rect 0.7x1.25 smd: 1(0.95,-1) 2(-0.95,-1) 3(0,1)
SW-TH_SW-18010P
  oval 0.9x1.2 hole 0.6: 1(0.6,0)
  oval 0.6x1 hole 0.4: 2(-0.6,0)
USIP-8_L3.0-W2.8-P0.65-TL-EP
  rect 0.65x0.45 smd: 1(-1.125,0.975) 2(-1.125,0.325) 3(-1.125,-0.325) 4(-1.125,-0.975) 5(1.125,-0.975) 6(1.125,-0.325) 7(1.125,0.325) 8(1.125,0.975)
  rect 1.1x1.9 smd: 9(0,0)

## Nets
As in the schematic, except:
2.5V: C2.2 C4.2 C5.2 C6.2 C7.2 C8.2 C9.2 C10.2 C11.2 C12.2 C13.2 C14.2 C15.2 C16.2 C17.2 C18.2 C19.2 C20.2 C21.2 C22.2 C23.2 C24.2 C45.2 C46.2 NOREF#4.6 R1.2 R2.2 R5.1 R6.1 R8.1 R9.1 R10.1 R11.1 R12.1 R13.1 R14.1 R15.1 R16.1 R17.1 R18.1 R19.1 R20.1 R21.1 R22.1 R23.1 R24.1 R25.1 R26.1 R27.1 R28.1 R29.1 R30.1 R31.1 R32.1 R33.1 R34.1 R35.1 R36.1 R37.1 R38.1 R39.1 R40.1 R41.1 R42.1 R43.1 R44.1 R45.1 R46.1 R47.1 R48.2 U1.4 U1.5 U2.4
GND: C1.1 C2.1 C3.1 C4.1 C5.1 C6.1 C7.1 C8.1 C9.1 C10.1 C11.1 C12.1 C13.1 C14.1 C15.1 C16.1 C17.1 C18.1 C19.1 C20.1 C21.1 C22.1 C23.1 C24.1 C45.1 C46.1 LED1.1 NOREF.5 NOREF#5.7 Q1.1 R3.1 R7.1 SW1.1 U1.3 U1.9 U2.3
BAT_+: C1.2 NOREF#3.5 U1.1 U1.2
UDPI: NOREF#2.4 U2.19

Pads without a net: U2 1 2 6 7 8 10 12 13 14 15 16 17 18 20 21

## Via types
v1: diameter 1.3, hole 0.7, Top Layer to Bottom Layer, 59 vias
v2: diameter 2.2, hole 1.5, Top Layer to Bottom Layer, 18 vias
v3: diameter 0.61, hole 0.305, Top Layer to Bottom Layer, 21 vias

## Routing (per net, layer and track width the routed paths; a pad name or vN(x,y) marks a point on that pad's centre or on a via; arc(x,y) is an arc through that point)
2.5V: length 497.5
  Top Layer w0.25: NOREF#4.6 68.14,41.81 67.25,40.92 ; 61.03,40.45 61.17,40.59 62.71,40.59 ; v3(65.09,36.08) 63.77,36.08 63.13,35.43 63.13,34.65 65.41,32.37 65.66,32.37
  Top Layer w0.3: v3(67.02,39.42) 67.17,39.57 R48.2 67.25,40.92
  Top Layer w0.4: v3(60.9,39.61) 60.9,40.32 61.03,40.45 C4.2 60.01,40.5 ; 58.74,40.5 C2.2 57.58,39.49 57.47,39.61 ; R1.2 58.31,42.09 58.36,42.15 58.36,42.6 R2.2 ; R1.2 57.6,41.26 ; R1.2 58.31,40.62 ; U1.5 57.56,40.96 57.6,41
  Top Layer w0.5: R46.1 93.16,28.9 93.68,29.42 93.68,33.18 93.09,33.77 92.21,33.77 C24.2 v1(92.57,37) ; 34.36,33.52 C46.2 32.9,33.07 32.23,32.93 27.88,33.08 ; 107.38,30.85 109.23,30.85 C6.2 v1(110.82,30.91) 112.28,30.91 R9.1
  Top Layer w0.6: 97.46,11.09 C11.2 96.94,13.74 v1(96.5,14.18) 96,14.68 R22.1 ; R42.1 45.74,40.57 v1(46.69,41.52) 47.57,42.41 C20.2 49.39,43.4 ; R27.1 C23.2 v1(46.27,20.62) R26.1 ; R17.1 C22.2 75.79,42.37 v1(76.67,41.49) 77.63,40.53 R16.1 ; R18.1 36.75,14.89 v1(37.28,14.36) 37.68,13.96 C9.2 38.24,11.18 ; 104.2,21.43 v1(105.48,20.54) C45.2 R5.1 ; R12.1 49.89,32.42 C13.2 51.58,32.32 v1(51.62,32.36) 53.08,32.36 53.15,32.28 ; 26.79,16 v1(26.39,14.52) C7.2 25.28,11.38 ; 78.23,21.34 v1(77.05,20.61) C19.2 R39.1 ; R44.1 v1(17.97,20.62) C21.2 15.24,18.56 ; R10.1 70.35,30.65 C5.2 72.89,30.65 73.57,31.34 ; R24.1 C10.2 84.93,48.66 v1(85.49,48.1) 85.9,47.69 R25.1 ; R33.1 37.8,49.88 v1(37.35,48.29) R32.1 ; R14.1 12.59,30.85 C12.2 12.69,30.86 v1(14.26,30.86) 15.81,30.86 R15.1 ; R21.1 v1(26.29,48.13) C8.2 25.18,51.32 ; 73.57,31.34 73.57,31.14 74.11,30.6 R11.1 ; 73.57,31.34 v1(73.57,31.86) ; R28.1 95.97,47.78 v1(96.4,48.2) 96.97,48.78 C15.2 R29.1 ; C16.2 84.44,11.29 ; R37.1 C14.2 16.66,42.34 v1(17.49,41.51) 18.48,40.52 R36.1
  Top Layer w0.7: 104.64,40.51 104.98,40.51 v1(105.91,41.44) 106.71,42.24 107.08,42.24 107.22,42.38 R40.1
  Top Layer w0.8: v1(84.76,31.78) 84.76,32 86.18,33.42 v1(86.18,35.35) 87.42,35.35 v1(88.5,36.43) 92,36.43 v1(92.57,37) 95.51,34.07 v1(96.6,34.07) 96.6,31.11 v1(97.11,30.6) 96.1,29.6 v1(96.1,27.55) 95.24,27.55 v1(93.14,25.46) 92.9,25.7 v1(88.34,25.7) 87.07,26.97 v1(86.86,26.97) ; C16.2 v1(85.44,14.35) R31.1 ; 33.21,25.52 arc(32.69,26.15) 31.96,26.51 arc(30.9,26.75) 29.84,26.92 arc(27.98,26.98) v1(26.13,26.86) arc(27.25,27.84) 28.25,28.94 arc(28.45,30.05) 27.9,31.05 arc(27.67,31.24) 27.4,31.4 ; 33.21,25.52 arc(33.36,26.13) 33.72,26.64 arc(34.52,27.22) 35.45,27.55 arc(36.92,27.5) v1(38.19,26.74) arc(38.35,29.4) v1(38.84,32.02) ; 33.21,25.52 arc(33.72,25.17) v1(34.15,24.72) arc(33.64,25.07) 33.21,25.52 ; 27.4,31.4 arc(26.2,31.55) v1(25.14,30.96) ; 27.4,31.4 arc(27.75,32.21) 27.88,33.08 arc(27.86,33.52) 27.78,33.94 arc(27.23,34.79) v1(26.27,35.12) arc(28.09,35.3) 29.85,35.82 arc(30.11,35.97) 30.32,36.18 ; v1(38.19,35.4) arc(37.1,34.93) 35.93,35.11 arc(34.57,36.31) v1(34.06,38.04) arc(32.35,36.81) 30.32,36.18 ; 30.32,36.18 arc(30.52,37.19) v1(29.84,37.96) ; R47.1 arc(33.9,28.91) 34.78,29.14 arc(35.52,29.87) 35.45,30.92 arc(35.14,31.78) 35.12,32.69 arc(34.93,33.28) 34.36,33.52
  Bottom Layer w0.3: v3(65.09,36.08) 66.86,36.08 67.02,36.24 v3(67.02,39.42)
  Bottom Layer w0.8: v1(17.49,41.51) v1(26.27,35.12) ; v1(88.5,36.43) v1(85.49,48.1) ; v1(37.28,14.36) v1(34.15,24.72) ; v1(34.06,38.04) v1(37.35,48.29) ; v1(85.44,14.35) v1(88.34,25.7) ; v1(26.29,48.13) v1(29.84,37.96) ; v1(86.18,35.35) v1(76.67,41.49) ; v1(38.19,35.4) v1(46.69,41.52) ; v1(77.05,20.61) v1(86.86,26.97) ; v1(96.5,14.18) v1(93.14,25.46) ; v1(105.48,20.54) v1(96.1,27.55) ; v1(26.39,14.52) 29.01,22.8 29.01,23.97 v1(26.13,26.86) arc(24.8,25.25) 23.08,24.09 arc(20.36,22.6) v1(17.97,20.62) ; v1(110.82,30.91) v1(97.11,30.6) ; v1(38.19,26.74) v1(46.27,20.62) ; v1(92.57,37) v1(96.4,48.2) ; v1(96.6,34.07) v1(105.91,41.44) ; v1(14.26,30.86) arc(19.13,30.81) 23.99,30.67 arc(24.58,30.76) v1(25.14,30.96)
  Bottom Layer w1: v3(60.01,39.61) v3(60.01,38.72) v3(60.9,38.72) ; 62.26,32.72 61.89,32.36 v1(51.62,32.36) 39.17,32.36 v1(38.84,32.02) ; v1(73.57,31.86) 73.09,31.38 72.08,31.38 71.08,32.38 v3(65.7,32.38) 62.91,32.38 61.76,33.52 61.76,37.85 v3(60.9,38.72) ; v3(60.9,38.72) v3(60.9,39.61)
  Bottom Layer w1.5: v1(73.57,31.86) 84.41,31.86
GND: length 488.3
  Top Layer w0.25: 62.41,41 61.88,41 C4.1 ; SW1.1 69.79,38.94 69.79,42.4 NOREF#5.7
  Top Layer w0.4: 55.26,42.66 55.01,42.91 v3(53.66,42.91) ; C1.1 56.27,37.82 U1.3 56.27,39.51 U1.9
  Top Layer w0.5: C6.1 109.35,32.37 v1(110.81,32.37) ; v3(63.31,31.14) 62.96,30.78 LED1.1 61.36,30.46 58.98,30.46 58.5,30.95 58.5,32.99 57.56,33.93 35.75,33.93 34.75,34.92 34.25,34.92 33.9,35.28 32.12,35.28 31.5,34.65 31.5,33.78
  Top Layer w0.6: v1(14.29,32.37) 12.7,32.37 C12.1 ; C5.1 71.95,33.16 72.33,33.54 v1(73.54,33.54) ; v1(51.59,30.63) 51.3,30.92 C13.1 ; v1(45.82,42.74) 46.62,43.54 C20.1 ; v1(38.78,14.85) 39.01,14.62 C9.1 ; 86.27,50.08 86.27,49.16 v1(86.9,48.53) ; v1(47.11,21.81) 48.37,20.7 ; C22.1 76.84,43.5 v1(77.61,42.73) ; v1(86.92,13.85) 86.28,13.21 C16.1 ; C45.1 107.41,20.67 v1(106.31,21.76) ; v1(27.69,48.62) C8.1 ; v1(27.79,14.03) 27.71,13.99 27.34,12.9 ; C18.1 105.78,43.51 v1(104.96,42.69) ; v1(17.05,21.79) C21.1 ; 98.31,49.41 98.31,48.01 v1(97.97,47.67) ; 98.27,13.11 98.27,14.33 v1(97.93,14.66) ; C19.1 75.11,20.68 v1(76.24,21.81) ; C14.1 17.62,43.48 v1(18.41,42.69) ; C17.1 v1(38.76,47.87)
  Top Layer w0.8: C24.1 89.11,33.74 85.88,30.39 83.24,30.42 80.53,33.74 80.23,33.82 74.11,33.82
  Bottom Layer w0.5: v3(63.31,31.14) 63.31,29.59 63.3,29.57
  Bottom Layer w0.8: 35.22,26.23 31.57,25.45 ; 35.22,26.23 38.17,28.42 ; 35.22,26.23 v1(38.78,14.85) ; 31.57,25.45 28.59,26.36 26.61,29.07 ; 31.57,25.45 v1(27.79,14.03) ; 26.61,29.07 26.34,32.32 ; 26.61,29.07 26.28,28.79 v1(17.05,21.79) ; 26.34,32.32 27.92,35.59 ; 26.34,32.32 v1(14.29,32.37) ; v1(110.81,32.37) 97.04,32.27 93.85,31.69 ; v1(76.24,21.81) 83.85,27.62 NOREF.5 ; NOREF.5 94.15,36.17 v1(97.97,47.67) ; NOREF.5 90.93,36.89 v1(86.9,48.53) ; NOREF.5 95.8,35.77 v1(104.96,42.69) ; NOREF.5 v1(86.92,13.85) ; NOREF.5 96.26,29.23 97.98,27.86 v1(106.31,21.76) ; NOREF.5 86.88,36.41 v1(77.61,42.73) ; NOREF.5 94.3,26.68 v1(97.93,14.66) ; v1(38.76,47.87) 35.25,36.48 ; 35.25,36.48 36.13,35.75 v1(45.82,42.74) ; 35.25,36.48 31.69,37.21 v1(27.69,48.62) ; 38.17,28.42 v1(47.11,21.81) ; 38.17,28.42 38.89,29.83 ; 31.42,37.24 27.92,35.59 ; 27.92,35.59 v1(18.41,42.69)
  Bottom Layer w1: 73.59,33.6 73.54,33.54 v1(73.54,33.54) ; 73.59,33.6 86.08,33.6 88.46,31.22 ; 73.59,33.6 63.63,33.6 62.86,34.36 62.86,36.94 ; 93.85,31.69 93.39,31.22 NOREF.5 ; 94.1,31.83 93.96,31.79 94.07,31.79 94.1,31.83
  Bottom Layer w2.2: 38.86,29.57 87.37,29.57 88.46,30.67 88.46,31.22 NOREF.5
  vias: v2(1.23,31.17) v2(7.08,49.22) v2(7.06,13.09) v2(22.44,60.59) v2(22.61,1.72) v2(41.61,60.64) v2(41.65,1.75) v2(57.08,13.03) v2(57.11,49.33) v2(66.35,49.51) v2(66.42,13) v2(81.77,60.64) v2(81.79,1.9) v2(100.88,60.59) v2(100.84,1.82) v2(116.28,49.39) v2(116.3,13.06) v2(122.23,31.31) v3(53.37,38.46) v3(53.47,37.57) v3(53.98,38.17) v3(59.65,42.91) v3(62.19,42.87) v3(65.85,38.34)
BAT_+: length 49.7
  Top Layer w0.4: 55.25,37.39 C1.2 55.14,37.34 ; 55.25,37.39 55.27,37.36 ; 55.25,37.39 55.25,37.34 ; 55.14,37.34 54.97,37.51 U1.1 ; 55.14,37.34 54.23,36.43 ; 55.14,37.34 55.19,37.29 55.25,37.34 ; v3(53.91,36.43) 54.23,36.43 ; 54.23,36.43 v3(54.8,36.43) ; v3(54.8,36.43) v3(55.69,36.43) ; v3(54.8,36.43) 55.25,36.88 55.25,36.88 ; v3(55.69,36.43) 55.25,36.88 ; v3(55.69,36.43) 56.2,36.43 ; 55.27,37.36 56.2,36.43 ; 55.27,37.36 55.25,37.34 ; 55.27,37.36 55.62,37.71 U1.2 ; 55.25,37.34 55.25,36.88 ; 56.2,36.43 56.7,36.43 v3(56.73,36.39) 56.24,36.39 56.2,36.43
  Bottom Layer w0.127: 32.32,31.22 32.32,31.35 32.07,31.61
  Bottom Layer w1: 32.07,31.61 34.86,31.61 36.92,33.66 60,33.66 60.58,34.23 60.58,35.87 60.06,36.39 v3(56.73,36.39) 56.7,36.43 v3(55.69,36.43) v3(54.8,36.43) v3(53.91,36.43)
MOSFET: length 4.4
  Top Layer w0.25: U2.9 64.49,37.22 R7.2 63.84,37.56 Q1.2
SWITCH: length 459.4
  Top Layer w0.5: LED4.1 105.24,29.83 114.56,29.83 LED5.1 ; LED24.1 95.01,47.13 95.42,48.88 LED25.1 ; LED43.1 30,30.24 30,28.21 30.56,27.66 31.11,27.66 31.36,27.91 34.2,27.91 34.59,28.3 arc(34.81,28.36) 35.03,28.43 arc(35.95,29.11) 36.35,30.19 37.2,31.03 37.2,32.49 37.96,33.26 40.74,33.26 41.67,32.33 41.67,29.78
  Top Layer w0.6: 26.52,44.15 25.85,45.83 23.85,51.99 23.55,53.29 ; 21.66,22.11 20.64,21.19 17.5,18.91 LED41.1 ; LED6.1 68.29,29.57 76.92,29.57 77.41,30.06 ; 79.3,38.38 76.81,40 72.71,42.98 LED13.1 ; LED3.1 103.79,20.4 107.99,17.35 LED2.1 ; LED29.1 36.94,50.74 36.15,48.32 35.2,44.93 ; LED23.1 46.53,18.99 43.35,21.3 LED22.1 ; 18.14,29.85 17.89,29.61 8.89,29.61 8.65,29.85 ; LED26.1 84.78,16.12 85.78,18.42 ; LED9.1 54.88,29.45 46.57,29.45 LED8.1 ; 73.01,16.4 76.13,18.5 76.4,18.69 80.75,22.07 ; LED18.1 95.36,13.74 LED19.1 ; 85.45,44.62 83.23,51.44 LED20.1 ; LED38.1 45.39,39.17 49.08,41.86 LED39.1 ; LED15.1 36.73,11.86 35.78,14.78 LED14.1 ; LED31.1 25.67,16.06 23.91,10.63 LED30.1 ; LED36.1 108.86,42.08 103.63,38.27 LED37.1 ; LED32.1 18.06,39.67 13.51,42.98 LED33.1
  Top Layer w0.8: 92.1,24.04 93.75,24.07 95.77,25.94 96.5,25.78 ; 92.1,24.04 LED18.1 ; 92.1,24.04 87.71,24.44 ; 87.67,37.7 85.74,44.02 ; 87.67,37.7 86.17,36.83 84.01,35.36 79.3,38.38 ; 87.67,37.7 92.66,38.83 ; 98.64,29.64 98.25,29.62 97.78,27.59 96.5,25.78 ; 98.64,29.64 98.52,31.63 98.19,34.84 ; 98.64,29.64 LED4.1 ; 98.19,34.84 LED37.1 ; 98.19,34.84 92.66,38.83 ; 84.09,28.02 84.45,27.25 85.09,25.5 ; 84.09,28.02 LED42.1 ; 84.09,28.02 83.78,28.7 81.47,29.56 77.41,30.06 ; 33.31,22.47 33.17,22.93 arc(32.84,23.41) 32.32,23.65 arc(32.23,23.66) 32.13,23.66 arc(30.26,23.84) 28.43,24.29 arc(28.24,21.19) LED31.1 ; 33.31,22.47 34.69,18.25 arc(34.9,18) LED14.1 ; 33.31,22.47 arc(35.26,22.42) 35.89,24.27 arc(35.98,24.95) 36.57,25.33 arc(38.38,25.17) 39.94,24.21 ; 87.71,24.44 85.78,18.42 ; 87.71,24.44 86.79,25.34 85.09,25.5 ; 85.09,25.5 80.75,22.07 ; 96.5,25.78 LED3.1 ; 92.66,38.83 92.62,38.86 LED24.1 ; 92.66,38.83 92.93,38.9 ; 21.66,22.11 21.79,22.11 23.56,23.88 arc(23.57,24.05) 23.56,24.21 arc(23.55,24.52) 23.56,24.83 ; LED38.1 arc(41.63,36.94) 38.76,36.76 arc(37.5,37.01) 36.25,37.28 arc(35.82,37.64) 35.85,38.2 arc(36.14,39.17) 35.94,40.17 arc(35.58,40.99) 35.27,41.83 arc(35.17,42.17) 35.09,42.51 ; 39.94,24.21 arc(40.11,24.02) 40.31,23.87 arc(41.46,23.05) LED22.1 ; 39.94,24.21 arc(39.6,24.97) 39.69,25.79 arc(39.87,26.6) 39.78,27.43 arc(40.13,29.08) 41.67,29.78 arc(43.83,29.79) LED8.1 ; 28.17,41.4 arc(27.86,41.65) 27.55,41.91 arc(26.79,42.91) 26.52,44.15 ; 28.17,41.4 arc(27.9,39.92) 28.34,38.48 arc(28.38,37.56) 27.64,37 arc(26.38,36.87) 25.12,36.88 arc(24.83,36.89) 24.54,36.92 ; 28.17,41.4 arc(28.67,41.03) 29.19,40.69 arc(30.24,39.86) 31.12,38.84 arc(31.82,38.41) 32.62,38.62 arc(33.4,39.55) 33.71,40.72 arc(34.11,41.84) 35.09,42.51 ; 35.09,42.51 arc(35,43.73) 35.2,44.93 ; LED32.1 arc(20.86,37.8) 21.8,37.41 arc(23.16,37.1) 24.54,36.92 ; 24.54,36.92 arc(24.8,35.27) 25.17,33.64 arc(25,32.85) 24.25,32.55 arc(23.59,32.27) 23.47,31.57 arc(23.35,30.6) 22.52,30.11 arc(20.34,29.97) LED11.1 ; 23.56,24.83 arc(23.65,25.43) 23.83,26.01 arc(24.37,27.03) 25.12,27.91 arc(25.42,28.65) 25.06,29.36 arc(24.1,29.89) 23.02,30.07 ; 23.56,24.83 arc(24.73,24.5) 25.81,25.07 arc(26.42,25.5) 27.17,25.61 arc(27.89,25.25) 28.18,24.49
  Top Layer w1: 64.98,30.06 64.98,31.47 62.61,33.84 62.36,33.84 61.79,34.41 Q1.3
  Top Layer w1.5: 55.46,29.55 55.93,29.48 56.42,29.48 58.54,29.24 62.7,29.24 64.98,30.06 LED6.1
UDPI: length 3.9
  Top Layer w0.25: 63.68,42.24 63.68,43.02 63.76,43.1 66.17,43.1 NOREF#2.4
VIB: length 10.2
  Top Layer w0.25: 67.83,39.58 67.88,39.53 67.88,37.32 68.36,36.85 SW1.2 ; 67.83,39.58 68.12,39.58 68.68,40.15 R48.1 ; 67.83,39.58 67.83,38.24 66.82,38.24 65.38,39.67 65.38,40.09 U2.11
$1N1273: length 8.2
  Top Layer w0.4: v3(59.4,42.09) 59.4,41.48 59.17,41.26 ; v3(54.3,42.15) 54.68,41.77 55.31,41.77 55.62,41.46 U1.7
  Bottom Layer w0.4: v3(59.4,42.09) 54.35,42.09 v3(54.3,42.15)
$1N1291: length 1.1
  Top Layer w0.4: 53.91,40.79 54.09,40.96 U1.8
$1N1523: length 3.2
  Top Layer w0.4: R2.1 56.13,42.66 56.27,42.51 U1.6
$1N2150: length 9.6
  Top Layer w0.25: R4.2 60.64,32.82 60.64,35.92 61.53,36.81 61.53,39.61 62.12,40.19 62.71,40.19
$1N2153: length 2.3
  Top Layer w0.25: R4.1 60.28,31.2 61.49,32.41 61.66,32.41
$1N2397: length 2.4
  Top Layer w0.6: LED2.2 R5.2
$1N2467: length 2.4
  Top Layer w0.6: LED3.2 R6.2
$1N2959: length 2.3
  Top Layer w0.5: 107.38,32.36 107.38,32.28 107.36,32.25 105.14,32.25
$1N2961: length 2.4
  Top Layer w0.5: 114.62,31.96 LED5.2 ; 112.25,32.21 114.62,32.21
$1N3108: length 2.5
  Top Layer w0.6: LED6.2 67.83,32.11 R10.2
$1N3110: length 2.4
  Top Layer w0.6: R11.2 77.38,32.11 LED7.2
$1N3257: length 2.8
  Top Layer w0.6: LED8.2 46.73,31.36 47.85,31.36 R12.2
$1N3259: length 2.9
  Top Layer w0.6: R13.2 53.35,30.78 53.85,31.28 54.64,31.28 LED9.2
$1N3406: length 2.5
  Top Layer w0.6: R14.2 9.02,32.36 LED10.2
$1N3408: length 2.5
  Top Layer w0.6: R15.2 17.79,32.36 LED11.2
$1N4472: length 2.4
  Top Layer w0.6: 78.82,41.75 LED12.2
$1N4474: length 2.4
  Top Layer w0.6: 74.91,44.56 LED13.2
$1N4476: length 2.4
  Top Layer w0.6: R18.2 37.09,18.4
$1N4478: length 2.4
  Top Layer w0.6: R19.2 40.01,9.27
$1N4480: length 2.4
  Top Layer w0.6: R20.2 25.52,53.93
$1N4482: length 2.4
  Top Layer w0.6: R21.2 LED17.2
$1N4484: length 2.4
  Top Layer w0.6: R22.2 LED18.2
$1N4486: length 2.4
  Top Layer w0.6: 98.89,11.56 99.29,9.14
$1N4488: length 2.4
  Top Layer w0.6: 85.85,51.68 LED20.2
$1N4490: length 2.5
  Top Layer w0.6: LED21.2 R25.2
$1N5215: length 2.4
  Top Layer w0.6: R26.2 LED22.2
$1N5217: length 2.4
  Top Layer w0.6: R27.2 LED23.2
$1N5219: length 2.4
  Top Layer w0.6: LED24.2 R28.2
$1N5221: length 2.4
  Top Layer w0.6: R29.2 LED25.2
$1N5223: length 2.4
  Top Layer w0.6: LED26.2 R30.2
$1N5225: length 2.5
  Top Layer w0.6: R31.2 LED27.2
$1N5227: length 2.5
  Top Layer w0.6: R32.2 LED28.2
$1N5229: length 2.5
  Top Layer w0.6: LED29.2 R33.2
$1N5231: length 2.4
  Top Layer w0.6: R34.2 LED30.2
$1N5233: length 2.4
  Top Layer w0.6: 28.23,15.53 28.59,17.89
$1N5958: length 2.3
  Top Layer w0.6: R36.2 21.28,40.09
$1N5960: length 2.4
  Top Layer w0.6: R37.2 LED33.2
$1N5962: length 2.5
  Top Layer w0.6: 77.35,22.56 LED34.2
$1N5964: length 2.5
  Top Layer w0.6: R39.2 LED35.2
$1N5966: length 2.4
  Top Layer w0.7: R40.2 LED36.2
$1N5968: length 2.4
  Top Layer w0.7: R41.2 102.02,40.03
$1N5970: length 2.5
  Top Layer w0.6: R42.2 LED38.2
$1N5972: length 2.4
  Top Layer w0.6: R43.2 50.64,45.75
$1N5974: length 2.4
  Top Layer w0.6: 18.31,22.66 LED40.2
$1N5976: length 2.4
  Top Layer w0.6: 14.36,19.78 LED41.2
$1N6160: length 3
  Top Layer w0.5: LED42.2 92.21,30.46 R46.2
$1N6162: length 2.9
  Top Layer w0.8: R47.2 LED43.2

## Copper pours and planes (outline as drawn; the poured copper is in the pictures)
2.5V on Top Layer: 56.58,41.51 56.58,38.21 57.86,38.21 58.11,38.46 60.9,38.46 61.15,38.72 61.15,40.77 60.72,41.21 59.96,41.21 59.5,40.75 58.99,40.75 58.87,40.88 58.87,41.64 58.74,41.77 56.83,41.77
GND on Top Layer: 52.71,43.52 52.71,35.52 70.57,35.52 70.72,35.67 70.72,43.52 52.83,43.52 52.81,43.54
GND on Top Layer: -2.8,69.85 133.16,69.85 133.16,-9.57 -2.8,-9.57
GND on Bottom Layer: 52.68,35.54 70.67,35.54 70.69,35.56 70.69,43.54 52.68,43.54
GND on Bottom Layer: -1.99,68.95 133.97,68.95 133.97,-10.46 -1.99,-10.46

Small or netless copper shapes (teardrops, artwork), in the pictures only: 1 on Top Layer

## Text on the board
Top Silkscreen Layer: robotfuze.com | bukajlag | 2024 | + | -
